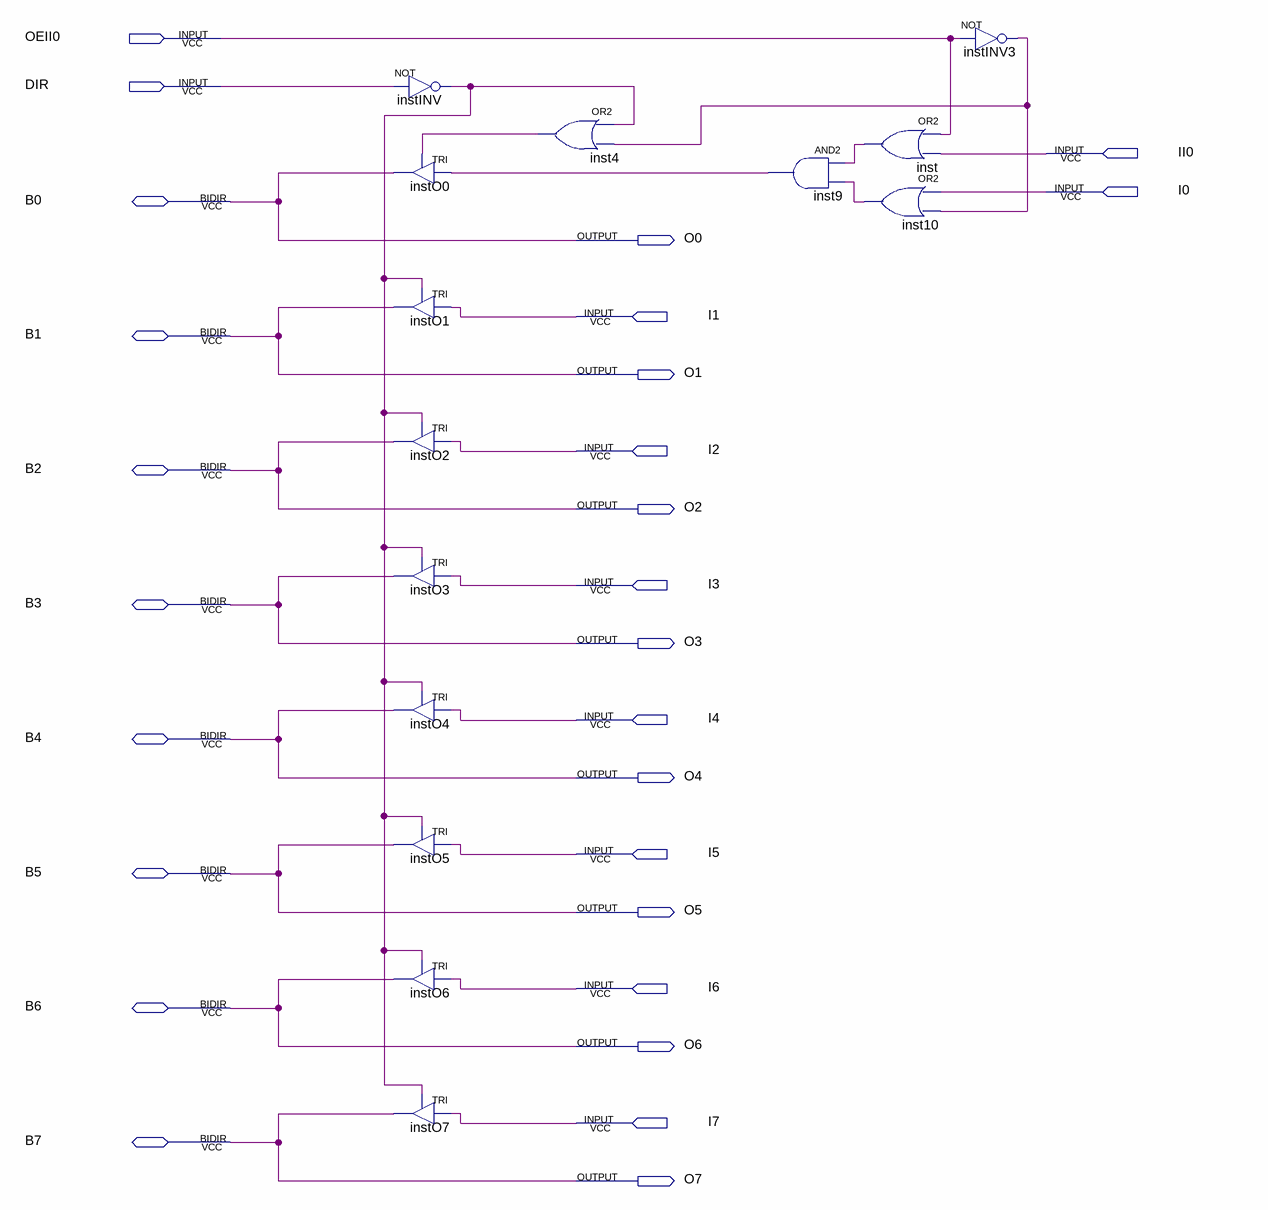
[diagram p0: schematic sheet]
// Quartus schematic 8bidir16_tri_b_1state.bdf as structural Verilog: 14 symbols, 27 pins
module \8bidir16_tri_b_1state  (
  input  OEII0,
  input  DIR,
  input  II0,
  input  I0,
  input  I1,
  input  I2,
  input  I3,
  input  I4,
  input  I5,
  input  I6,
  input  I7,
  inout  B0,
  inout  B1,
  inout  B2,
  inout  B3,
  inout  B4,
  inout  B5,
  inout  B6,
  inout  B7,
  output O0,
  output O1,
  output O2,
  output O3,
  output O4,
  output O5,
  output O6,
  output O7
);

  wire inst4_out, inst9_out, inst10_out, inst_out, instINV3_out, instINV_out;

  not instINV (instINV_out, DIR);
  TRI instO0 (.IN(inst9_out), .OE(inst4_out), .OUT(B0));
  TRI instO1 (.IN(I1), .OE(instINV_out), .OUT(B1));
  TRI instO2 (.IN(I2), .OE(instINV_out), .OUT(B2));
  TRI instO3 (.IN(I3), .OE(instINV_out), .OUT(B3));
  TRI instO4 (.IN(I4), .OE(instINV_out), .OUT(B4));
  TRI instO5 (.IN(I5), .OE(instINV_out), .OUT(B5));
  TRI instO6 (.IN(I6), .OE(instINV_out), .OUT(B6));
  TRI instO7 (.IN(I7), .OE(instINV_out), .OUT(B7));
  or inst4 (inst4_out, instINV_out, instINV3_out);
  and inst9 (inst9_out, inst_out, inst10_out);
  or inst (inst_out, OEII0, II0);
  or inst10 (inst10_out, I0, instINV3_out);
  not instINV3 (instINV3_out, OEII0);

  assign O0 = B0;
  assign O1 = B1;
  assign O2 = B2;
  assign O3 = B3;
  assign O4 = B4;
  assign O5 = B5;
  assign O6 = B6;
  assign O7 = B7;
endmodule
